# EAGLE design merkur-osdgruve-42 (EAGLE 7.4.0)
REVISION: 1.0
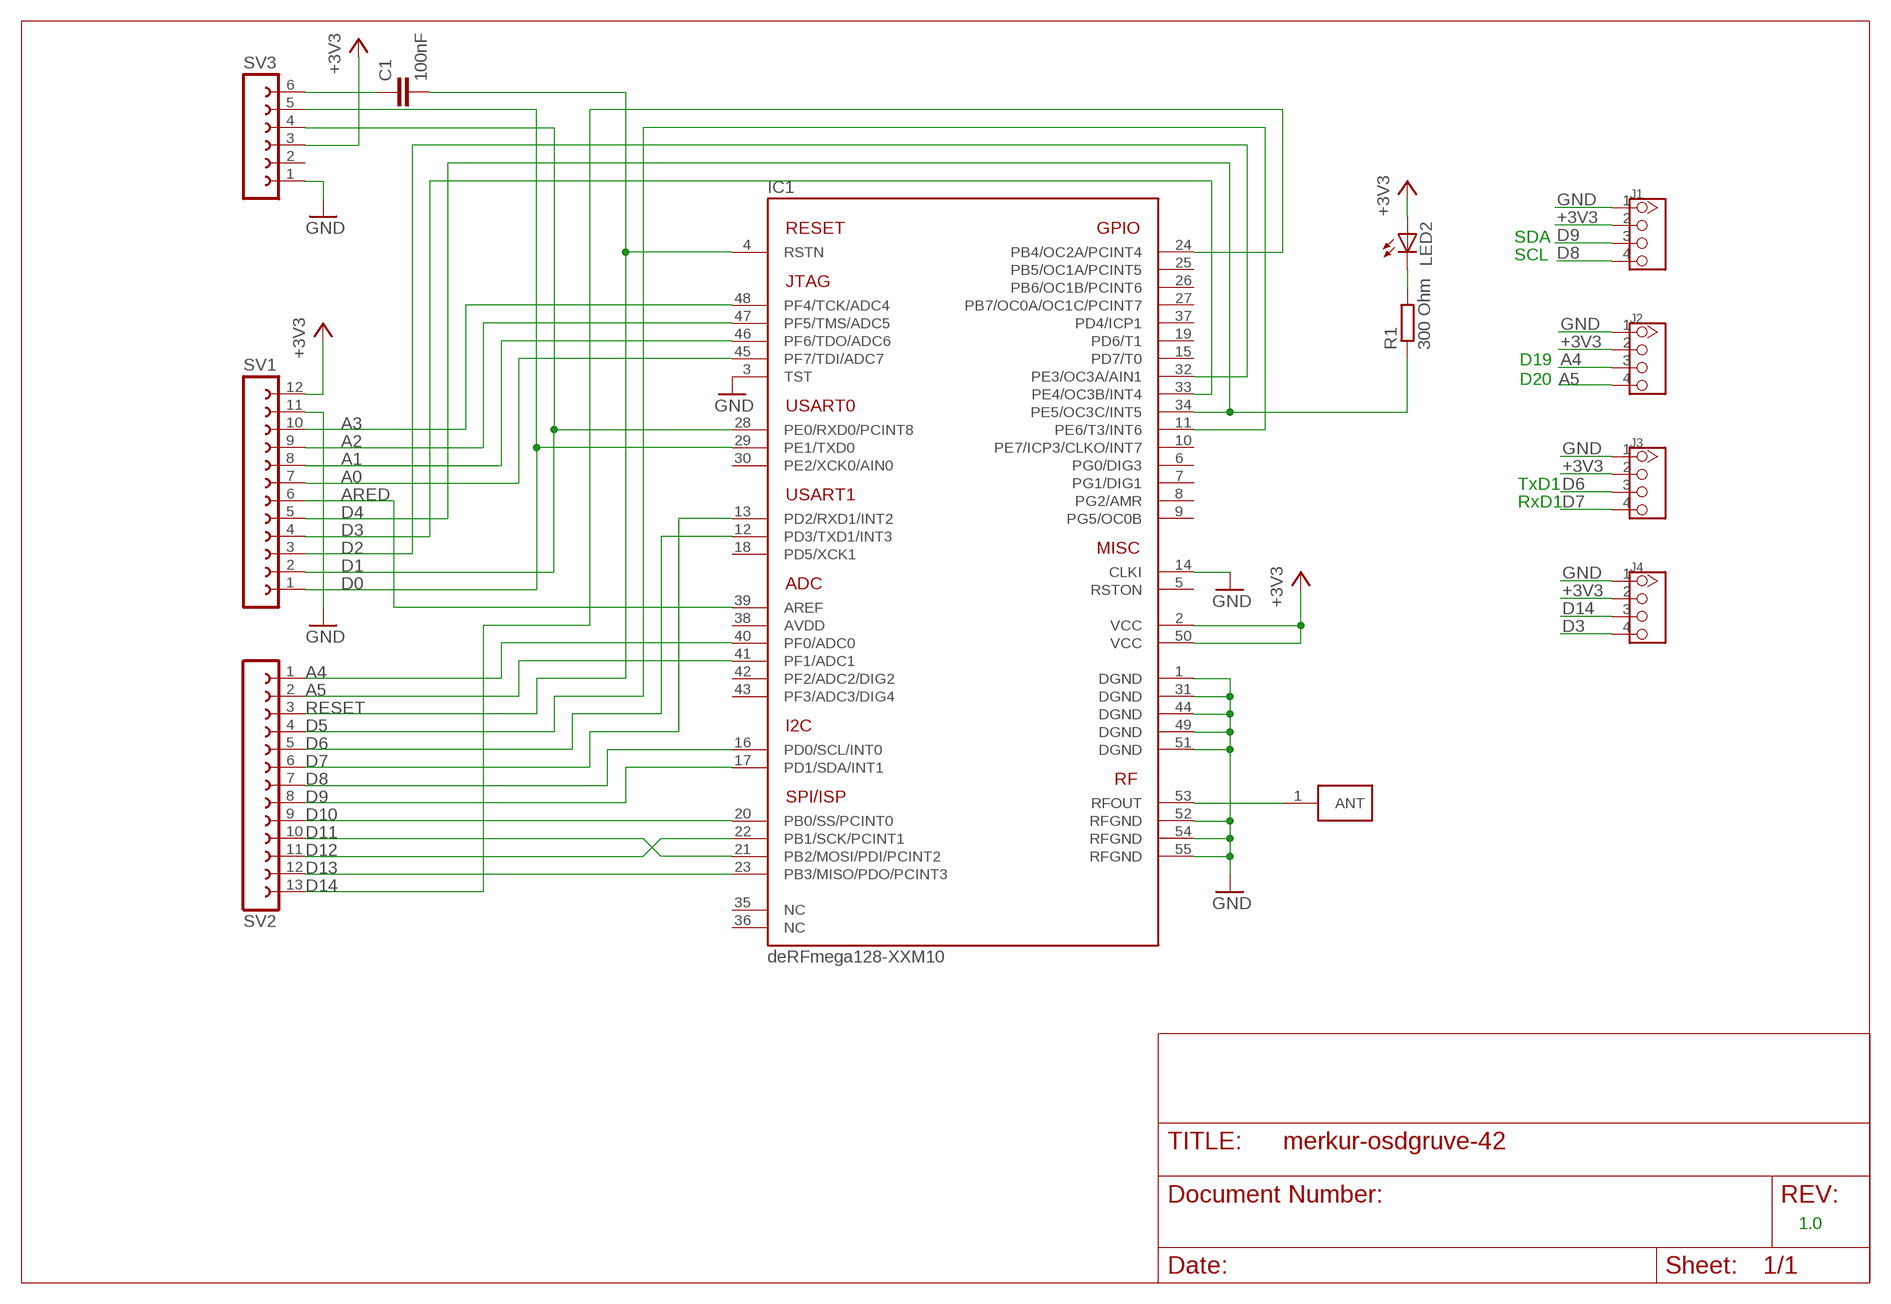
[diagram p0: schematic, sheet 1]

## Parts
C1  100nF  C-EUC0603  [C0603]
IC1  DERFMEGA128-XXM10  [A-M10]
J1  CONNECTOR_TWIG-4P-2.0-2.0  [CONNECTOR_4P-2.0]
J2  CONNECTOR_TWIG-4P-2.0-2.0  [CONNECTOR_4P-2.0]
J3  CONNECTOR_TWIG-4P-2.0-2.0  [CONNECTOR_4P-2.0]
J4  CONNECTOR_TWIG-4P-2.0-2.0  [CONNECTOR_4P-2.0]
LED2  LEDCHIP-LED0603  [CHIP-LED0603]
R1  300 Ohm  R-EU_R0603  [R0603]
SV1  FE12-1  [FE12]
SV2  FE13-1  [FE13]
SV3  FE06-1  [FE06]
U$1  PAD  [FE05-1]

## Nets
+3V3: IC1.2(VCC) IC1.50(VCC) J1.2 J2.2 J3.2 J4.2 LED2.A SV1.12 SV3.3
A0: IC1.45(PF7/TDI/ADC7) SV1.7
A1: IC1.46(PF6/TDO/ADC6) SV1.8
A2: IC1.47(PF5/TMS/ADC5) SV1.9
A3: IC1.48(PF4/TCK/ADC4) SV1.10
A4: IC1.40(PF0/ADC0) J2.3 SV2.1
A5: IC1.41(PF1/ADC1) J2.4 SV2.2
ARED: IC1.39(AREF) SV1.6
D0: IC1.29(PE1/TXD0) SV1.1 SV3.5
D1: IC1.28(PE0/RXD0/PCINT8) SV1.2 SV3.4
D2: IC1.32(PE3/OC3A/AIN1) SV1.3
D3: IC1.33(PE4/OC3B/INT4) J4.4 SV1.4
D4: IC1.34(PE5/OC3C/INT5) R1.1 SV1.5
D5: IC1.11(PE6/T3/INT6) SV2.4
D6: IC1.12(PD3/TXD1/INT3) J3.3 SV2.5
D7: IC1.13(PD2/RXD1/INT2) J3.4 SV2.6
D8: IC1.16(PD0/SCL/INT0) J1.4 SV2.7
D9: IC1.17(PD1/SDA/INT1) J1.3 SV2.8
D10: IC1.20(PB0/SS/PCINT0) SV2.9
D11: IC1.21(PB2/MOSI/PDI/PCINT2) SV2.10
D12: IC1.22(PB1/SCK/PCINT1) SV2.11
D13: IC1.23(PB3/MISO/PDO/PCINT3) SV2.12
D14: IC1.24(PB4/OC2A/PCINT4) J4.3 SV2.13
GND: IC1.1(DGND) IC1.3(TST) IC1.14(CLKI) IC1.31(DGND) IC1.44(DGND) IC1.49(DGND) IC1.51(DGND) IC1.52(RFGND) IC1.54(RFGND) IC1.55(RFGND) J1.1 J2.1 J3.1 J4.1 SV1.11 SV3.1
N$23: LED2.C R1.2
N$25: C1.1 SV3.6
RESET: C1.2 IC1.4(RSTN) SV2.3
RFOUT: IC1.53(RFOUT) U$1.1(ANT)
Unconnected: IC1.5(RSTON) IC1.6(PG0/DIG3) IC1.7(PG1/DIG1) IC1.8(PG2/AMR) IC1.9(PG5/OC0B) IC1.10(PE7/ICP3/CLKO/INT7) IC1.15(PD7/T0) IC1.18(PD5/XCK1) IC1.19(PD6/T1) IC1.25(PB5/OC1A/PCINT5) IC1.26(PB6/OC1B/PCINT6) IC1.27(PB7/OC0A/OC1C/PCINT7) IC1.30(PE2/XCK0/AIN0) IC1.35(NC) IC1.36(NC) IC1.37(PD4/ICP1) IC1.38(AVDD) IC1.42(PF2/ADC2/DIG2) IC1.43(PF3/ADC3/DIG4) SV3.2

## Notes on the sheet
- SDA
- SCL
- D19
- D20
- TxD1
- RxD1

## Library data of the parts
C1 = rcl:C-EU: CAPACITOR, European symbol
IC1 = deRFmodules:DERFMEGA128-XXM10: deRFmega128 IEEE 802.15.4 Low Power Wireless Radio Module Microcontroller: Atmel ATmega128RFA1 Transceiver: integrated Manufacturer: dresden elektronik ingenieurtechnik gmbh Website: http://www.dresden-elektronik.de
J1-J4 = Grove-Base Shield v1.3:CONNECTOR_TWIG-4P-2.0
LED2 = led:LED: LED OSRAM: - CHIPLED LG R971, LG N971, LY N971, LG Q971, LY Q971, LO R971, LY R971 LH N974, LH R974 LS Q976, LO Q976, LY Q976 LO Q996 - Hyper CHIPLED LW Q18S LB Q993, LB Q99A, LB R99A - SideLED LS A670, LO A670, LY A670, LG A670, LP A670 LB A673, LV A673, LT A673, LW A673 LH A674 LY A675 LS A676, LA A676, LO A676, LY A676, LW A676 LS A679, LY A679, LG A679 - Hyper Micro SIDELED® LS Y876, LA Y876, LO Y876, LY Y876 LT Y87S - SmartLED LW L88C, LW L88S LB L89C, LB L89S, LG L890 LS L89K, LO L89K, LY L89K LS L896, LA L896, LO L896, LY L896 - TOPLED LS T670, LO T670, LY T670, LG T670, LP T670 LSG T670, LSP T670, LSY T670, LOP T670, LYG T670 LG T671, LOG T671, LSG T671 LB T673, LV T673, LT T673, LW T673 LH T674 LS T676, LA T676, LO T676, LY T676, LB T676, LH T676, LSB T676, LW T676 LB T67C, LV T67C, LT T67C, LS T67K, LO T67K, LY T67K, LW E67C LS E67B, LA E67B, LO E67B, LY E67B, LB E67C, LV E67C, LT E67C LW T67C LS T679, LY T679, LG T679 LS T770, LO T770, LY T770, LG T770, LP T770 LB T773, LV T773, LT T773, LW T773 LH T774 LS E675, LA E675, LY E675, LS T675 LS T776, LA T776, LO T776, LY T776, LB T776 LHGB T686 LT T68C, LB T68C - Hyper Mini TOPLED® LB M676 - Mini TOPLED Santana® LG M470 LS M47K, LO M47K, LY M47K Source: http://www.osram.convergy.de LUXEON: - LUMILED® LXK2-PW12-R00, LXK2-PW12-S00, LXK2-PW14-U00, LXK2-PW14-V00 LXK2-PM12-R00, LXK2-PM12-S00, LXK2-PM14-U00 LXK2-PE12-Q00, LXK2-PE12-R00, LXK2-PE12-S00, LXK2-PE14-T00, LXK2-PE14-U00 LXK2-PB12-K00, LXK2-PB12-L00, LXK2-PB12-M00, LXK2-PB14-N00, LXK2-PB14-P00, LXK2-PB14-Q00 LXK2-PR12-L00, LXK2-PR12-M00, LXK2-PR14-Q00, LXK2-PR14-R00 LXK2-PD12-Q00, LXK2-PD12-R00, LXK2-PD12-S00 LXK2-PH12-R00, LXK2-PH12-S00 LXK2-PL12-P00, LXK2-PL12-Q00, LXK2-PL12-R00 Source: www.luxeon.com KINGBRIGHT: KA-3528ASYC Source: www.kingbright.com
R1 = rcl:R-EU_: RESISTOR, European symbol
SV1 = con-lsta:FE12-1: FEMALE HEADER; OC_FARNELL: unknown; OC_NEWARK: unknown
SV2 = con-lsta:FE13-1: FEMALE HEADER; OC_FARNELL: unknown; OC_NEWARK: unknown
SV3 = con-lsta:FE06-1: FEMALE HEADER; OC_FARNELL: unknown; OC_NEWARK: unknown
U$1 = Pad:PAD

## Board
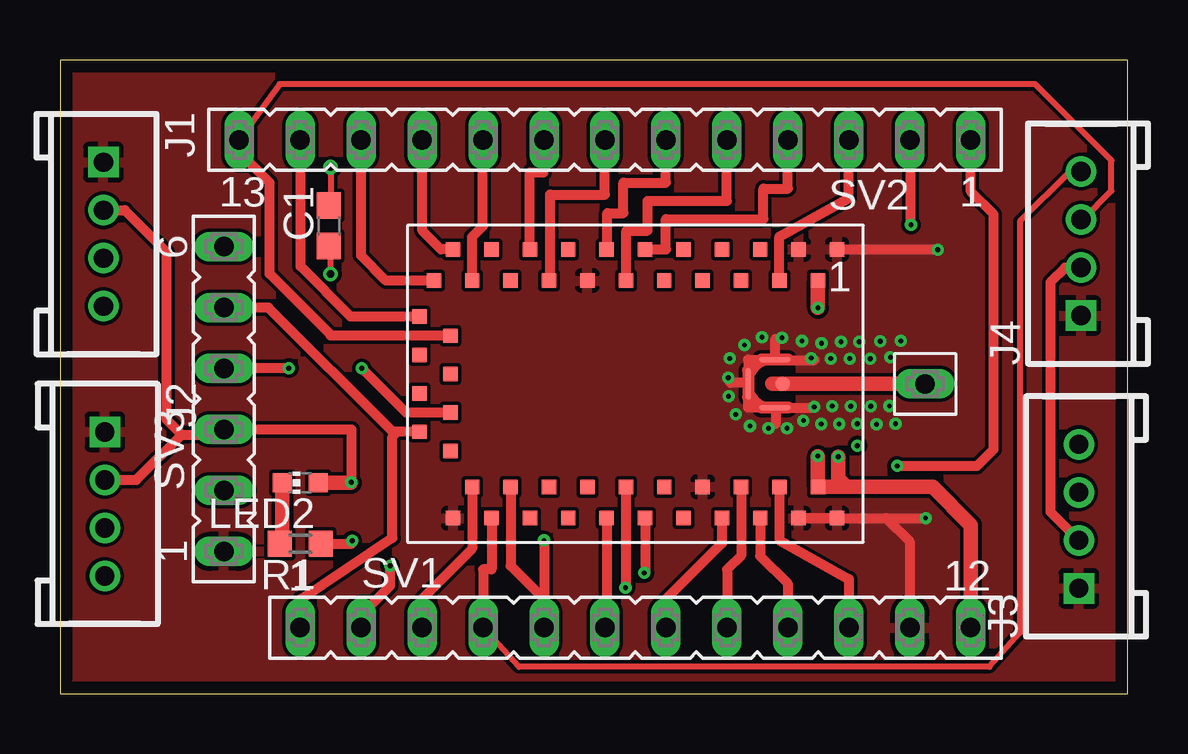
[diagram p1: board, top side]
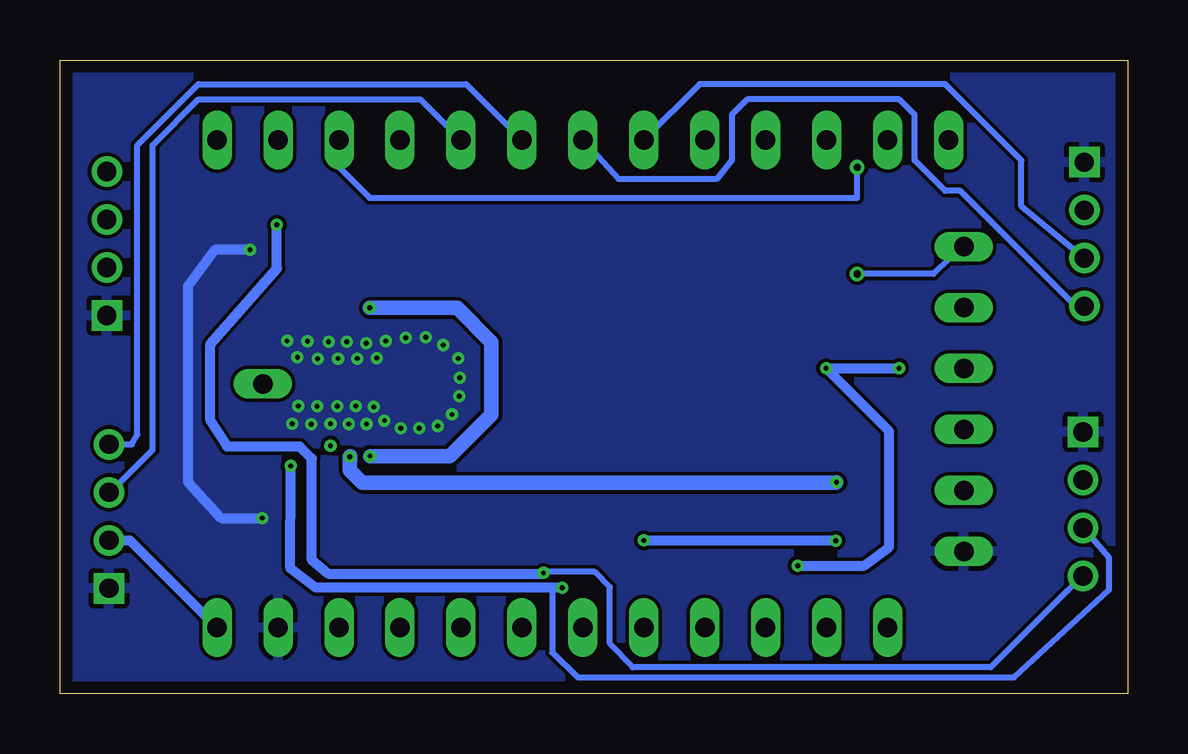
[diagram p2: board, bottom side, seen from below]

Size 44.49 x 26.41 mm. Coordinates in mm from the lower left corner, seen from the top.
Outline: 0,0 44.49,0 44.49,26.41 0,26.41 0,0
Copper layers (1*16): Top 0.035mm / dielectric 1.5mm / Bottom 0.035mm
Design rules "PCB-POOL": minimum track width 6mil, minimum drill 12mil, track to track 6mil, track to pad 6mil, pad to pad 6mil, via to via 6mil, smd to smd 6mil, copper to edge 20mil, drill to drill 8mil, minimum pad ring 8mil, minimum via ring 6mil, stop-mask expansion 3mil, vias tented up to drill 0mil, thermal gap 8mil

### Footprints (pad centres in the part's own frame; a part is rotated, then mirrored left to right if it is on the bottom)
C0603 = smd 1.1 x 1: 1 -0.85,0; 2 0.85,0
A-M10 = smd 0.6 x 0.6: 1 -8.4,-5.6; 2 -7.6,-4.3; 3 -6.8,-5.6; 4 -6,-4.3; 5 -5.2,-5.6; 6 -4.4,-4.3; 7 -3.6,-5.6; 8 -2.8,-4.3; 9 -2,-5.6; 10 -1.2,-4.3; 11 -0.4,-5.6; 12 0.4,-4.3; 13 1.2,-5.6; 14 2,-4.3; 15 2.8,-5.6; 16 3.6,-4.3; 17 4.4,-5.6; 18 5.2,-4.3; 19 6,-5.6; 20 6.8,-4.3; 21 7.6,-5.6; 22 8.4,-4.3; 23 9,-2.8; 24 7.7,-2; 25 9,-1.2; 26 7.7,-0.4; 27 9,0.4; 28 7.7,1.2; 29 9,2; 30 7.7,2.8; 31 7.6,5.6; 32 6.8,4.3; 33 6,5.6; 34 5.2,4.3; 35 4.4,5.6; 36 3.6,4.3; 37 2.8,5.6; 38 2,4.3; 39 1.2,5.6; 40 0.4,4.3; 41 -0.4,5.6; 42 -1.2,4.3; 43 -2,5.6; 44 -2.8,4.3; 45 -3.6,5.6; 46 -4.4,4.3; 47 -5.2,5.6; 48 -6,4.3; 49 -6.8,5.6; 50 -7.6,4.3; 51 -8.4,5.6; 53 -6.14,0 | smd 1.3 x 0.2: 52 -5.8,1; 54 -5.8,-1 | smd 0.2 x 1.3: 55 -4.7,0
CONNECTOR_4P-2.0 = drill 0.8 pad 1.27 square: 1 -3,0 | drill 0.8 pad 1.27: 2 -1,0; 3 1,0; 4 3,0
CHIP-LED0603 = smd 0.8 x 0.8: A 0,-0.75; C 0,0.75
R0603 = smd 1 x 1.1: 1 -0.85,0; 2 0.85,0
FE12 = drill 0.813 long: 1 -13.97,0; 2 -11.43,0; 3 -8.89,0; 4 -6.35,0; 5 -3.81,0; 6 -1.27,0; 7 1.27,0; 8 3.81,0; 9 6.35,0; 10 8.89,0; 11 11.43,0; 12 13.97,0
FE13 = drill 0.813 long: 1 -15.24,0; 2 -12.7,0; 3 -10.16,0; 4 -7.62,0; 5 -5.08,0; 6 -2.54,0; 7 0,0; 8 2.54,0; 9 5.08,0; 10 7.62,0; 11 10.16,0; 12 12.7,0; 13 15.24,0
FE06 = drill 0.813 long: 1 -6.35,0; 2 -3.81,0; 3 -1.27,0; 4 1.27,0; 5 3.81,0; 6 6.35,0
FE05-1 = drill 0.813 long: 1 -5.08,0

### Placement (x,y rotation side)
C1  11.21,19.5 90 top
IC1  23.98,12.92 180 top
J1  1.81,19.15 270 top
J2  1.87,7.91 270 top
J3  42.45,7.39 90 top
J4  42.54,18.76 90 top
LED2  10.01,8.79 90 top
R1  10.01,6.25 180 top
SV1  23.98,2.76 0 top
SV2  22.71,23.08 180 top
SV3  6.83,12.28 90 top
U$1  36.04,17.99 90 top

### Tracks (layer width: path | path; a pad name or v marks a point on that pad's centre or on a via)
+3V3  (via drill 0.2)
  Top 0.254: 31.6,9.74 v31.58,9.9
  Top 0.406: SV1.12 | 12.12,8.79 v12.14,8.81 12.14,11.01 SV3.3 6.61,10.79 5.07,10.79 | IC1.2 | J2.2 3.19,8.91 5.07,10.79 | J1.2 2.7,20.15 4.44,18.41 4.44,11.43 5.07,10.79 | J4.2 41.88,17.76 41.27,17.14 41.27,7.58 J3.2
  Top 0.61: 32.77,8.62 IC1.50 v31.58,9.9 | 32.77,8.62 36.36,8.62 37.95,7.03 SV1.12 | LED2.A 12.12,8.79 | v32.42,9.88 32.42,8.96 32.77,8.62 | v31.58,16.08 IC1.2
  Bottom 0.406: 32.4,9.89 v32.42,9.88 | J3.2 41.58,6.39 SV1.12
  Bottom 0.61: 32.4,9.89 32.4,9.74 | v12.14,8.81 12.16,8.79 31.89,8.79 32.41,9.31 32.41,9.87 v32.42,9.88 | v31.58,9.9 28.25,9.9 26.52,11.62 26.52,14.65 27.95,16.08 v31.58,16.08
A0
  Top 0.406: IC1.45 27.58,6.27 25.22,3.91 25.22,2.79 SV1.7
A1
  Top 0.406: IC1.46 28.38,5.76 27.8,5.18 27.8,2.77 SV1.8
A2
  Top 0.406: IC1.47 29.18,5.74 30.32,4.59 SV1.9
A3
  Top 0.406: IC1.48 29.98,6.4 32.87,4.78 SV1.10
A4  (via drill 0.2)
  Top 0.406: IC1.40 23.58,4.43 v23.56,4.42 | v34.88,9.49 34.89,9.5 38.21,9.5 38.9,10.19 38.9,19.97 37.95,20.92 SV2.1
  Bottom 0.254: 23.99,4.42 23.99,1.72 22.91,0.68 4.74,0.68 0.78,4.33 0.78,5.67 J2.3
  Bottom 0.406: v34.88,9.49 34.88,9.31 34.89,5.23 33.83,4.42 23.99,4.42 v23.56,4.42
A5  (via drill 0.2)
  Top 0.406: IC1.41 24.38,5.02 v24.35,5.04 | v35.46,19.54 35.46,23.03 SV2.2
  Bottom 0.254: J2.4 2.5,4.3 5.71,1.09 20.63,1.09 21.58,2.08 21.58,4.45 22.22,5.08 24.3,5.08
  Bottom 0.406: v35.46,19.54 35.46,17.71 38.22,14.57 38.22,11.39 37.53,10.31 37.47,10.31 37.45,10.29 34.5,10.29 34,9.79 34,5.56 33.33,5.01 24.41,5.01 v24.35,5.04 24.3,5.08
ARED
  Top 0.406: IC1.39 22.78,2.83 SV1.6
D0
  Top 0.406: IC1.29 14.06,10.92 | 14.06,10.92 13.86,10.92 8.69,16.09 7.85,16.09 SV3.5 | SV1.1 10.01,3.92 13.85,6.49 13.85,10.71 14.06,10.92
D1  (via drill 0.2)
  Top 0.406: IC1.28 14.42,11.72 v12.57,13.56 | v9.54,13.57 8.37,13.57 SV3.4 | SV1.2 12.55,3.29 13.76,4.5 v13.76,5.34
  Bottom 0.406: 12.55,13.54 v12.57,13.56 | v12.57,13.56 v9.54,13.56 v9.54,13.57 | v13.76,5.34 10.97,5.34 9.94,6.11 9.94,10.93 v12.57,13.56
D2
  Top 0.406: IC1.32 17.18,6.05 15.1,3.97 15.1,2.77 SV1.3
D3
  Top 0.254: J4.4 42.07,21.76 40,19.68 40,2.54 38.73,1.12 19.12,1.12 SV1.4
  Top 0.406: IC1.33 17.98,5.19 17.63,5.19 SV1.4
D4  (via drill 0.2)
  Top 0.406: IC1.34 18.78,5.33 20.17,3.94 20.17,3.81 | 20.17,3.81 SV1.5 | R1.1 12.17,6.25 v12.18,6.38 | v20.17,6.39 20.17,3.9 20.17,3.81
  Bottom 0.406: v12.18,6.38 20.2,6.38 v20.17,6.39
D5
  Top 0.406: IC1.11 25.25,18.52 25.25,19.78 29.31,19.78 29.31,21.05 30.33,21.05 SV2.4
D6
  Top 0.406: IC1.12 23.6,17.22 23.6,19.29 24.48,19.29 24.48,20.54 27.79,20.54 SV2.5
  Bottom 0.152: J3.3 42.4,8.39
  Bottom 0.254: 42.4,8.39 40.63,10.16 40.63,22.86 38.73,24.77 29.47,24.77 SV2.5
D7
  Top 0.406: IC1.13 22.81,18.52 22.81,20.03 23.47,20.03 23.47,21.3 25.25,21.3 SV2.6
  Bottom 0.254: J3.4 41.5,10.39 41.27,10.79 41.27,22.86 38.73,25.4 27.57,25.4 SV2.6
D8
  Top 0.406: IC1.16 20.42,17.22 20.42,20.79 22.71,20.79 SV2.7
  Bottom 0.254: J1.4 2.17,16.15 6.98,20.95 7.61,20.95 8.88,22.23 8.88,24.13 9.52,24.77 15.87,24.77 16.5,24.13 16.5,22.23 17.14,21.44 21.22,21.44 SV2.7
D9
  Top 0.406: IC1.17 19.58,21.72 20.15,21.71 20.15,23.06 SV2.8
  Bottom 0.152: J1.3
  Bottom 0.254: J1.3 4.44,20.32 4.44,22.23 7.61,25.4 17.85,25.4 SV2.8
D10
  Top 0.406: IC1.20 17.18,19.04 17.62,19.48 17.62,23.07 SV2.9
D11
  Top 0.406: IC1.21 15.87,18.52 15.1,19.3 15.1,23.07 SV2.10
D12
  Top 0.406: IC1.22 13.58,17.22 12.54,18.26 SV2.11
D13
  Top 0.406: IC1.23 12.11,15.72 10.02,17.81 10.02,23.06 SV2.12
D14
  Top 0.152: J4.3 42.61,19.76
  Top 0.254: 42.61,19.76 43.81,20.95 43.81,22.23 40.63,25.4 9.15,25.4 SV2.13
  Top 0.406: IC1.24 11.28,14.92 11.28,14.95 8.74,17.49 8.74,21.3 7.47,22.57 SV2.13
GND  (via drill 0.2)
  Top 0.406: SV1.11 35.4,6.34 34.42,7.32 IC1.51 IC1.49 35.98,7.32 v36.06,7.32 | v36.57,18.5 32.4,18.5 IC1.1 | v31.42,11.95 31.27,11.92 IC1.52 28.68,11.92 IC1.55 28.68,13.92 IC1.54 | 29.82,11.9 29.82,11.24 | 28.66,12.96 27.94,12.96 | 31.38,13.93 | 29.81,13.91 29.81,14.77 | 29.58,13.9 31.43,13.9
  Bottom 0.406: v36.07,7.32 v36.06,7.32 v36.07,7.32 37.77,7.32 39.17,8.84 39.17,16.99 38.04,18.5 v36.57,18.5
  other vias: 31.73,14.61 32.54,14.66 33.3,14.67 31.3,13.99 32.11,13.96 32.91,13.96 34.6,14.02 33.76,13.96 34.18,14.69 32.17,11.99 32.95,11.98 32.46,11.24 33.22,11.25 33.78,11.98 34.02,11.23 34.56,11.99 30.91,14.7 30.08,14.84 29.25,14.85 28.52,14.53 27.9,13.97 27.84,13.17 27.86,12.4 28.16,11.64 28.75,11.15 29.52,11.06 30.29,11.06 30.98,11.38 31.72,11.24 35.03,14.7 34.81,11.25
  pour Bottom: -1.28,27.3 45.71,27.3 45.71,-1.27 -1.28,-1.27
  pour Top: -1.28,27.3 45.71,27.3 45.71,-1.27 -1.28,-1.27
N$23
  Top 0.61: LED2.C 9.26,6.35 R1.2
N$25  (via drill 0.3)
  Top 0.152: 11.28,18.12 C1.1
  Top 0.254: v11.28,17.49 11.28,18.12
  Bottom 0.254: v11.28,17.49 8.1,17.49 7.47,18.12 6.83,18.12 SV3.6
N$26  (via drill 0.2)
  other vias: 33.22,10.34
RESET  (via drill 0.3)
  Top 0.254: v11.28,21.93 11.28,20.66 C1.2
  Top 0.406: IC1.4 29.98,19.04 32.86,20.65 32.86,23.07 SV2.3
  Bottom 0.254: v11.28,21.93 11.28,20.66 31.6,20.66 32.87,21.93 SV2.3
RFOUT
  Top 0.61: IC1.53 U$1.1

### Text on the board
bLabel: http://www.coxcoon.at